# EAGLE design sensorCR123 (EAGLE 6.6.0)
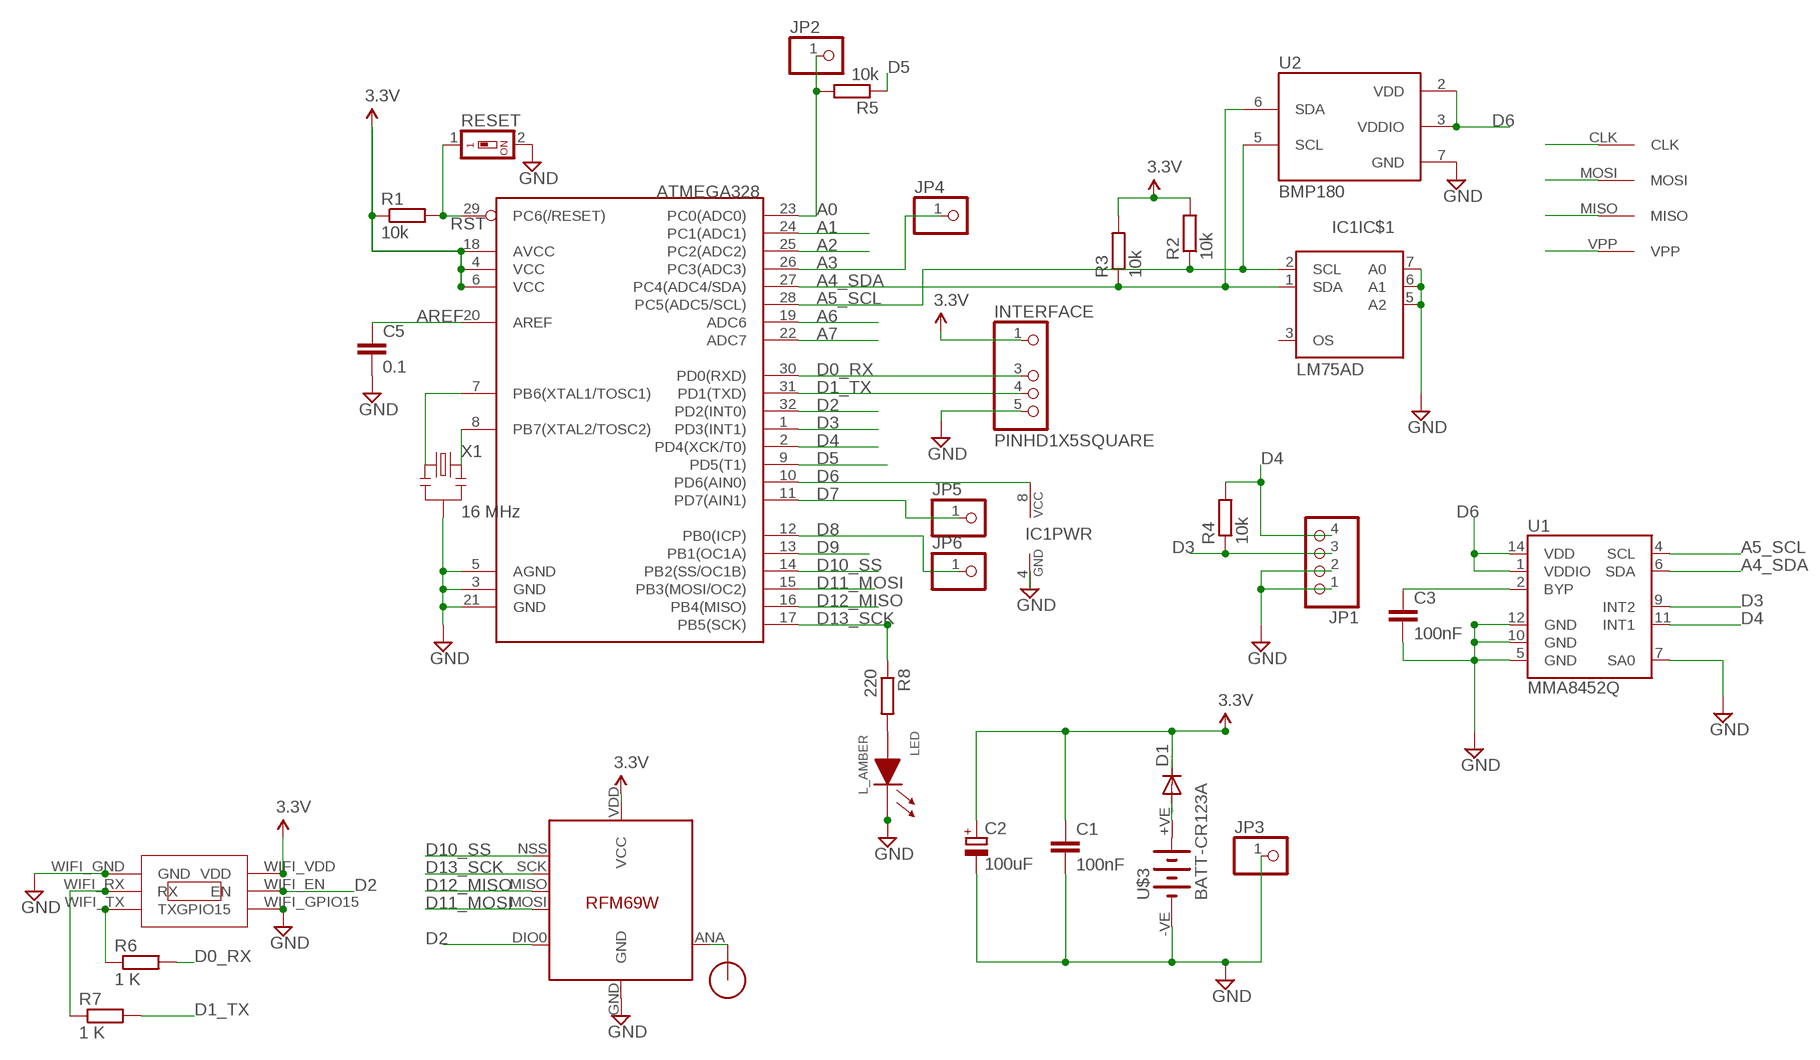
[diagram p0: schematic, sheet 1]

## Parts
ATMEGA328  ATMega-328  ATMEGA168/328TQFP32  [TQFP32-08]
C1  100nF  C-EUC2012  [C2012]
C2  100uF  CPOL-EUSMCB  [SMC_B]
C3  100nF  C-EUC2012  [C2012]
C5  0.1  C-EUC2012  [C2012]
D1  DIODE-DO214BA  [DO214BA]
IC1  LM75AD  [SO08]
INTERFACE  PINHD1X5SQUARE  [PINHD1X05-SQUARE]
JP1  PINHD-1X04_2.54-S  [1X04-S]
JP2  PINHD-1X01_2.54  [1X01]
JP3  PINHD-1X01_2.54  [1X01]
JP4  PINHD-1X01_2.54  [1X01]
JP5  PINHD-1X01_2.54  [1X01]
JP6  PINHD-1X01_2.54  [1X01]
LED  L_AMBER  LED0805  [LED0805]
R1  10k  R-EU_R2012  [R2012]
R2  10k  R-EU_R2012  [R2012]
R3  10k  R-EU_R2012  [R2012]
R4  10k  R-EU_R2012  [R2012]
R5  10k  R-EU_R2012  [R2012]
R6  1 K  R-EU_M2012  [M2012]
R7  1 K  R-EU_M2012  [M2012]
R8  220  R-EU_M2012  [M2012]
RESET  SWS001  [SMS-001]
U1  MMA8452Q  [QFN-16_0.5MM]
U2  BMP180  [BMP180]
U$1  RFM12B_ANTENNA  [RFM12B-ANTENNA]
U$2  AVRHEADERDIP  [AVRHEADER]
U$3  BATT-CR123A  [KEYSTONE-2/3A]
U$4  RFM69W  [RFM69W]
U$5  ESP03  [ESP03]
X1  16 MHz  RESONATORSMD  [RESONATOR-SMD]

## Nets
A0: ATMEGA328.23(PC0(ADC0)) JP2.1 R5.2
A1: ATMEGA328.24(PC1(ADC1))
A2: ATMEGA328.25(PC2(ADC2))
A3: ATMEGA328.26(PC3(ADC3)) JP4.1
A4_SDA: ATMEGA328.27(PC4(ADC4/SDA)) IC1.1(IC$1:SDA) R3.1 U1.6(SDA) U2.6(SDA)
A5_SCL: ATMEGA328.28(PC5(ADC5/SCL)) IC1.2(IC$1:SCL) R2.1 U1.4(SCL) U2.5(SCL)
A6: ATMEGA328.19(ADC6)
A7: ATMEGA328.22(ADC7)
AREF: ATMEGA328.20(AREF) C5.1
D0_RX: ATMEGA328.30(PD0(RXD)) INTERFACE.3 R6.2
D1_TX: ATMEGA328.31(PD1(TXD)) INTERFACE.4 R7.2
D2: ATMEGA328.32(PD2(INT0)) U$4.DIO0 U$5.WIFI_EN(EN)
D3: ATMEGA328.1(PD3(INT1)) JP1.3 R4.1 U1.9(INT2)
D4: ATMEGA328.2(PD4(XCK/T0)) JP1.4 R4.2 U1.11(INT1)
D5: ATMEGA328.9(PD5(T1)) R5.1
D6: ATMEGA328.10(PD6(AIN0)) IC1.8(PWR:VCC) U1.1(VDDIO) U1.14(VDD) U2.2(VDD) U2.3(VDDIO)
D7: ATMEGA328.11(PD7(AIN1)) JP5.1
D8: ATMEGA328.12(PB0(ICP)) JP6.1
D9: ATMEGA328.13(PB1(OC1A))
D10_SS: ATMEGA328.14(PB2(SS/OC1B)) U$4.NSS(SEL)
D11_MOSI: ATMEGA328.15(PB3(MOSI/OC2)) U$2.MOSI U$4.MOSI
D12_MISO: ATMEGA328.16(PB4(MISO)) U$2.MISO U$4.MISO
D13_SCK: ATMEGA328.17(PB5(SCK)) R8.1 U$2.CLK U$4.SCK
GND: ATMEGA328.3(GND) ATMEGA328.5(AGND) ATMEGA328.21(GND) C1.2 C2.- C3.2 C5.2 IC1.4(PWR:GND) IC1.5(IC$1:A2) IC1.6(IC$1:A1) IC1.7(IC$1:A0) INTERFACE.5 JP1.1 JP1.2 JP3.1 LED.1(CA) RESET.2 U1.5(GND) U1.7(SA0) U1.10(GND) U1.12(GND) U2.7(GND) U$3.-VE(-) U$4.GND U$5.WIFI_GND(GND) U$5.WIFI_GPIO15(GPIO15) X1.2
N$1: ATMEGA328.7(PB6(XTAL1/TOSC1)) X1.1
N$2: C3.1 U1.2(BYP)
N$3: U$1.P$1 U$4.ANA(ANT)
N$4: LED.2(AN) R8.2
N$5: D1.A U$3.+VE(+)
N$10: R6.1 U$5.WIFI_TX(TX)
N$11: R7.1 U$5.WIFI_RX(RX)
N$21: ATMEGA328.8(PB7(XTAL2/TOSC2)) X1.3
RST: ATMEGA328.29(PC6(/RESET)) R1.2 RESET.1 U$2.VPP
VCC: ATMEGA328.4(VCC) ATMEGA328.6(VCC) ATMEGA328.18(AVCC) C1.1 C2.+ D1.C INTERFACE.1 R1.1 R2.2 R3.2 U$4.VDD(VCC) U$5.WIFI_VDD(VDD) ; supply symbol labelled 3.3V
Unconnected: IC1.3(IC$1:OS)

## Library data of the parts
ATMEGA328 = LowPowerLab:ATMEGA168/328: Atmel 32-pin 8-bit micro, 16k flash.
C1 C3 C5 = resistor:C-EU: CAPACITOR, European symbol
C2 = resistor:CPOL-EU: POLARIZED CAPACITOR, European symbol
D1 = diode:DIODE-: DIODE
IC1 = i2c:LM75AD: Digital Temperature Sensor and Thermal Watchdog
INTERFACE = eagle-library-edeca.net-v5:PINHD1X5
JP1 = pinhead-2:PINHD-1X04: PIN HEADER
JP2-JP6 = pinhead-2:PINHD-1X01: PIN HEADER
LED = MySMD:LED0805
R1-R8 = resistor:R-EU_: RESISTOR, European symbol
RESET = smd-special:SWS001: SMD Dip Switch 1 pol.
U1 = SparkFun-Sensors:MMA8452Q: MMA8452Q 3-Axis, 12/8-bit Digital Accelerometer Supply Voltage: 1.6-3.6V Range: +/- 2g, 4g, 8g Interface: I2C, 12-bit and 8-bit ODR: 1.56 Hz - 800 Hz Package: QFN-16 http://cache.freescale.com/files/sensors/doc/data_sheet/MMA8452Q.pdf; PROD_ID: IC-10769
U2 = SparkFun-Sensors:BMP180: BOSCH BMP180 DIGITAL BAROMETRIC PRESSURE SENSOR Web page: http://www.bosch-sensortec.com/en/homepage/products_3/environmental_sensors_1/bmp180_1/bmp180 Datasheet: http://ae-bst.resource.bosch.com/media/products/dokumente/bmp180/BST-BMP180-DS000-09.pdf The BMP180 is the function compatible successor of the BMP085, a new generation of high precision digital pressure sensors for consumer applications. The ultra-low power, low voltage electronics of the BMP180 is optimized for use in mobile phones, PDAs, GPS navigation devices and outdoor equipment. With a low altitude noise of merely 0.25m at fast conversion time, the BMP180 offers superior performance. The I2C interface allows for easy system integration with a microcontroller. The BMP180 is based on piezo-resistive technology for EMC robustness, high accuracy and linearity as well as long term stability. Key features: - Temperature measurement included - I2C interface - Fully calibrated - Pb-free, halogen-free and RoHS compliant, - MSL 1 Basic specs: Pressure range: 300 to 1100hPa (+9000m to -500m relating to sea level) Supply voltage: 1.8 to 3.6V (VDD), 1.62V to 3.6V (VDDIO) Package: LGA package with metal lid Small footprint: 3.6mm x 3.8mm Super-flat: 0.93mm height Low power: 5μA at 1 sample / sec. in standard mode Low noise: 0.06hPa (0.5m) in ultra low power mode, 0.02hPa (0.17m) advanced resolution mode Typical applications: - Enhancement of GPS navigation (dead-reckoning, slope detection, etc.) - In- and out-door navigation - Leisure and sports - Weather forecast - Vertical velocity indication (rise/sink speed)
U$1 = LowPowerLab:RFM12B_ANTENNA
U$2 = RemoteHome:AVRHEADER
U$3 = eagle-library-edeca.net-v5:BATT-CR123A: CR123A (2/3rd AA) battery holder Manufacturer: Keystone Mouser part: 534-1019
U$4 = RemoteHome:RFM69W
U$5 = RemoteHome:ESP03
X1 = SparkFun:RESONATOR: Resonator Small SMD resonator. This is the itty bitty 10/20MHz resonators with built in caps. CSTCE10M0G55 and CSTCE20M0V53. Footprint has been reviewed closely but hasn't been tested yet.

## Net classes
1 power: width 0.381 mm, clearance 0.254 mm

## Board
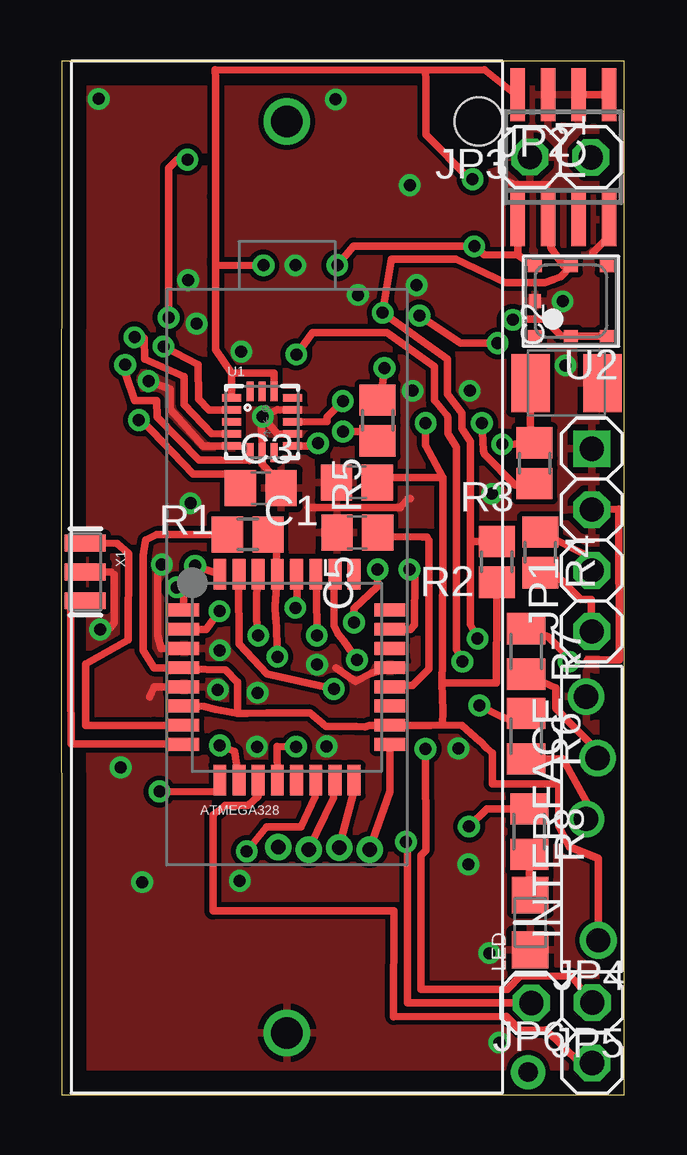
[diagram p1: board, top side]
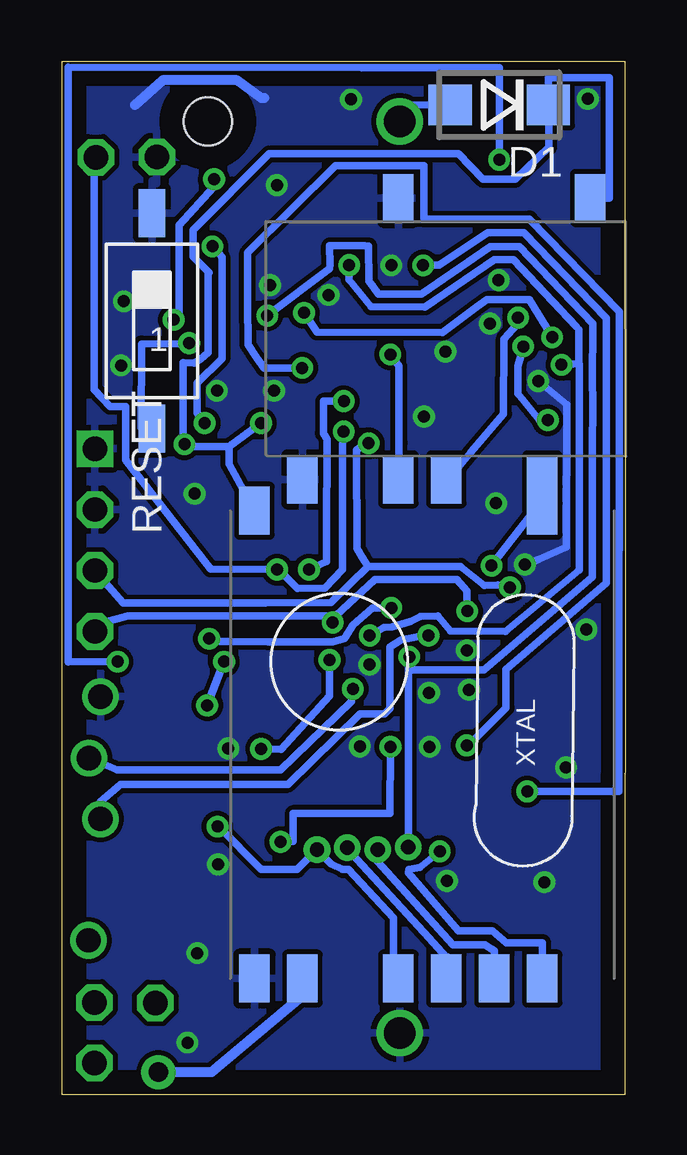
[diagram p2: board, bottom side, seen from below]

Size 23.48 x 43.09 mm. Coordinates in mm from the lower left corner, seen from the top.
Outline: 0.02,0 23.48,0.01 23.47,43.09 0.02,43.09 0.02,37.02 0,26.86 0.02,0
Copper layers (1*16): Top 0.035mm / dielectric 1.5mm / Bottom 0.035mm
Design rules "default": minimum track width 10mil, minimum drill 24mil, track to track 8mil, track to pad 8mil, pad to pad 8mil, via to via 8mil, smd to smd 8mil, copper to edge 40mil, drill to drill 8mil, minimum pad ring 10mil, minimum via ring 8mil, stop-mask expansion 4mil, vias tented up to drill 0mil, thermal gap 10mil

### Footprints (pad centres in the part's own frame; a part is rotated, then mirrored left to right if it is on the bottom)
TQFP32-08 = smd 1.27 x 0.533: 1 -4.293,2.8; 2 -4.293,2; 3 -4.293,1.2; 4 -4.293,0.4; 5 -4.293,-0.4; 6 -4.293,-1.2; 7 -4.293,-2; 8 -4.293,-2.8; 17 4.293,-2.8; 18 4.293,-2; 19 4.293,-1.2; 20 4.293,-0.4; 21 4.293,0.4; 22 4.293,1.2; 23 4.293,2; 24 4.293,2.8 | smd 0.533 x 1.27: 9 -2.8,-4.293; 10 -2,-4.293; 11 -1.2,-4.293; 12 -0.4,-4.293; 13 0.4,-4.293; 14 1.2,-4.293; 15 2,-4.293; 16 2.8,-4.293; 25 2.8,4.293; 26 2,4.293; 27 1.2,4.293; 28 0.4,4.293; 29 -0.4,4.293; 30 -1.2,4.293; 31 -2,4.293; 32 -2.8,4.293
C2012 = smd 1.3 x 1.5: 1 -0.85,0; 2 0.85,0
SMC_B = smd 1.6 x 2.4: + -1.5,0; - 1.5,0
DO214BA = smd 1.8 x 1.7: A 2.05,0; C -2.05,0
SO08 = smd 0.6 x 2.2: 1 -1.905,-2.6; 2 -0.635,-2.6; 3 0.635,-2.6; 4 1.905,-2.6; 5 1.905,2.6; 6 0.635,2.6; 7 -0.635,2.6; 8 -1.905,2.6
PINHD1X05-SQUARE = drill 1.016: 1 -5.061,-0.269; 3 0,0.24; 4 2.54,-0.24; 5 5.099,0.24
1X04-S = drill 1.016 square: 1 -3.81,0 | drill 1.016 octagon: 2 -1.27,0; 3 1.27,0; 4 3.81,0
1X01 = drill 1.016 octagon: 1 0,0
LED0805 = smd 1.524 x 1.524: 1 0,0; 2 2.286,0
R2012 = smd 1.3 x 1.5: 1 -0.85,0; 2 0.85,0
M2012 = smd 1.3 x 1.6: 1 -0.95,0; 2 0.95,0
SMS-001 = smd 1.092 x 2.007: 1 0,-4.496; 2 0,4.496
QFN-16_0.5MM = smd 0.8 x 0.3: 1 -1.275,1; 2 -1.275,0.5; 3 -1.275,0; 4 -1.275,-0.5; 5 -1.275,-1; 9 1.275,-1; 10 1.275,-0.5; 11 1.275,0; 12 1.275,0.5; 13 1.275,1 | smd 0.3 x 0.8: 6 -0.5,-1.275; 7 0,-1.275; 8 0.5,-1.275; 14 0.5,1.275; 15 0,1.275; 16 -0.5,1.275
BMP180 = smd 0.6 x 0.5: 1 1.5,1.45; 2 0,1.45; 3 -1.5,1.45; 4 -1.5,-1.45; 5 0,-1.45; 6 1.5,-1.45 | smd 0.5 x 0.6: 7 1.5,0
RFM12B-ANTENNA = drill 0.8 pad 1.422: P$1 0,0
AVRHEADER = drill 0.6 pad 0.813: CLK 2.54,0; MISO 1.27,0.091; MOSI 0,0; VPP -1.27,0.099
KEYSTONE-2/3A = drill 1.3: +VE 0,19; -VE 0,-19 | hole 2: 8,19
RFM69W = smd 2 x 1.27: ANA 9.27,-5; DIO0 -10.23,5; GND 9.27,-7; MISO 9.27,1; MOSI 9.27,3; NSS 9.27,5; SCK 9.27,-1; VDD -10.23,-7
ESP03 = smd 1.27 x 2: WIFI_EN 3.27,-6; WIFI_GND -6.73,-6; WIFI_GPIO15 -2.73,5.73; WIFI_RX -0.73,-6; WIFI_TX -2.73,-6; WIFI_VDD 5.27,5.73
RESONATOR-SMD = smd 0.7 x 1.7: 1 -1.2,0; 2 0,0; 3 1.2,0

### Placement (x,y rotation side)
ATMEGA328  9.41,17.41 0 top
C1  12.32,25.53 180 top
C2  21.06,29.67 0 top
C3  8.32,25.29 0 top
C5  12.34,23.44 180 top
D1  5.25,41.27 180 bottom
IC1  20.93,39.09 0 top
INTERFACE  22.12,11.5 90 top
JP1  22.12,23.13 270 top
JP2  22.08,39.08 0 top
JP3  19.54,39.09 0 top
JP4  22.14,3.85 0 top
JP5  22.13,1.33 0 top
JP6  19.6,3.84 0 top
LED  19.55,6.05 90 top
R1  7.77,23.37 0 top
R2  18.16,22.22 270 top
R3  19.73,26.33 90 top
R4  19.97,22.62 270 top
R5  13.19,28.12 270 top
R6  19.37,14.95 270 top
R7  19.38,18.49 270 top
R8  19.52,10.97 270 top
RESET  19.74,32.27 0 bottom
U1  8.37,28.06 0 top
U2  21.25,33.09 180 top
U$1  19.47,0.95 0 top
U$2  10.32,10.22 0 top
U$3  9.4,21.58 0 top
U$4  8.46,14.13 270 bottom
U$5  6.73,31.65 0 bottom
X1  1,21.8 270 top

### Tracks (layer width: path | path; a pad name or v marks a point on that pad's centre or on a via)
A0  (via drill 0.5)
  Top 0.305: v14.52,21.9 14.75,21.71 14.73,19.59 14.55,19.41 ATMEGA328.23 | ATMEGA328.23 | v11.74,27.65 12.99,27.66 R5.2
  Bottom 0.305: JP2.1 22.08,39.03 22.14,39.01 22.14,29.41 21.47,28.69 20.83,28.69 20.83,26.47 17.3,21.92 v14.52,21.9 14.4,21.86 14.48,21.89 14.41,21.85 14.3,21.74 13.67,21.11 12.51,21.12 11.78,21.91 11.78,27.03 v11.74,27.65
A3  (via drill 0.5)
  Top 0.305: ATMEGA328.26 11.38,21.7 11.38,19.56 11.55,19.22 11.77,18.94 v12.33,18.13 | v15.19,14.42 15.2,10.2 14.99,9.99 14.99,4.41 18.58,4.4 18.59,4.4 19.15,4.96 21.27,4.95 JP4.1
  Bottom 0.305: v12.33,18.13 12.34,16.64 14.36,14.4 v15.19,14.42
A4_SDA  (via drill 0.5)
  Top 0.305: ATMEGA328.27 10.64,20.98 v10.66,19.15 | U1.6 7.85,26.45 6.64,26.46 6.11,26.46 5.74,26.46 4,28.27 3.97,28.94 3.05,28.94 2.69,30.04 v2.66,30.44 | IC1.1 19.03,35 | 19.03,35 U2.6 | R3.1 18.92,25.41 17.64,26.72 17.6,26.85 v17.54,28.01 | 19.03,35 17.62,35.02 17.31,35.37 v17.22,35.38 12.19,35.39 v11.51,34.59
  Bottom 0.305: v10.66,19.15 10.05,19.48 9.73,19.51 8.96,19.73 8.54,19.95 7.81,19.96 7.29,19.34 5,19.31 1.92,21.88 1.92,30.47 1.93,30.48 | 1.93,30.48 1.94,31.9 2.05,32.03 4.67,34.82 5.04,34.81 5.46,34.81 8.34,32.85 10.61,32.86 11.52,33.98 11.51,34.15 v11.51,34.59 | v17.22,35.38 16.81,34.92 16.82,30.7 17.85,29.67 17.85,28.43 17.71,28.24 v17.54,28.01 | v2.66,30.44 2.18,30.45 1.93,30.48
A5_SCL  (via drill 0.5)
  Top 0.305: ATMEGA328.28 9.83,20.6 v9.76,20.3 | U1.4 6.27,27.56 5.13,28.77 5.12,29.94 3.47,30.68 3.45,31.55 3.16,31.62 v3.05,31.58 | IC1.2 20.29,36.48 20.42,35.31 20.96,34.55 U2.5 20.82,34.11 20.51,33.98 20.16,33.86 18.51,33.86 16.45,34.83 13.77,34.83 v13.4,32.6 16.1,30.67 16.1,30.09 16.1,29.22 16.7,28.43 16.7,27.78 17.05,27.24 17.06,24.33 17.05,23.81 17.06,23.16 | 17.06,23.16 17.05,19.6 v17.36,19.02 | R2.1 17.11,23.06 17.06,23.16
  Bottom 0.305: v9.76,20.3 10.55,20.3 11.36,19.58 11.7,19.04 12.21,18.88 13.98,18.89 14.9,18.89 16.47,18.89 16.89,18.89 v17.36,19.02 | v3.05,31.58 4,33.14 5.78,33.15 6.2,32.85 7.63,31.78 12.85,31.8 v13.4,32.6
AREF
  Top 0.305: C5.1 13.58,23.27 15.06,23.26 15.25,23.25 15.33,23.11 15.34,22.83 15.33,22.65 15.33,17.76 14.63,17.07 13.76,17.07 ATMEGA328.20
D0_RX  (via drill 0.5)
  Top 0.305: v8.21,19.15 8.15,19.84 8.14,20.07 8.15,21.89 ATMEGA328.30 | R6.2 20.92,14 21.88,12.24 INTERFACE.3
  Bottom 0.305: v8.21,19.15 8.38,19.15 9.35,18.96 9.81,18.67 9.81,16.1 10.04,15.88 11.06,15.89 14.07,12.94 21.05,12.95 21.88,12.24 INTERFACE.3
D1_TX  (via drill 0.5)
  Top 0.305: v11.36,16.92 8.57,17.55 7.41,18.81 7.4,21.41 ATMEGA328.31 | R7.2 20.62,16.95 20.62,16.12 21.27,15.44 22.35,14.36 INTERFACE.4
  Bottom 0.305: v11.36,16.92 11.42,16.41 14.37,13.54 21.18,13.54 INTERFACE.4
D2  (via drill 0.5)
  Top 0.305: v5.57,22.06 5.86,21.95 ATMEGA328.32
  Bottom 0.305: 3.51,25.05 3.86,25.47 3.88,24.26 v5.57,22.06
  Bottom 0.406: 3.51,25.05 3.55,24.83 U$4.DIO0 3.47,25.31 U$5.WIFI_EN
D3  (via drill 0.5)
  Top 0.305: ATMEGA328.1 5.09,20.76 v4.81,21.16 | R4.1 22.11,22.38 JP1.3 | v10.7,27.16 10.63,27.09 10.6,27.06 9.85,27.05 U1.9
  Bottom 0.305: JP1.3 20.93,20.51 18.42,20.5 15,20.5 12.26,20.52 10.72,22.02 | 10.72,22.02 6.86,22.04 5.88,21.23 5.31,21.25 v4.81,21.16 | 10.72,22.02 10.97,22.43 11.18,22.79 11.2,26.89 10.8,27.16 v10.7,27.16
D4  (via drill 0.5)
  Top 0.305: ATMEGA328.2 6.04,19.41 v6.59,20.16 | U1.11 11.08,28.06 11.08,28.25 v11.74,28.92 | R4.2 20.55,21.77 21.66,20.66 22.11,20.66 JP1.4 | v13.19,21.9 13.18,21.2 12.21,20.27 12.19,20.04 v12.2,19.7
  Bottom 0.305: v6.59,20.16 6.61,21 7.02,21.48 10.45,21.48 12.09,19.96 | 12.09,19.96 20.76,19.97 21.74,19.69 JP1.4 | v13.19,21.9 12.46,22.24 12.46,23.28 12.44,27.33 12.59,27.58 12.58,28.86 12.58,28.92 v11.74,28.92 | 12.09,19.96 v12.2,19.7
D5  (via drill 0.5)
  Top 0.305: R5.1 13.35,29.23 v13.47,30.31 | v4.09,12.65 6.6,12.64 ATMEGA328.9
  Bottom 0.305: v13.47,30.31 15.06,30.29 15.38,30.74 15.73,31.28 15.74,33.02 15.74,35.1 12.08,38.74 10.46,38.73 9.62,38.73 8.4,38.74 8.39,36.52 3.99,36.52 0.25,32.66 0.26,12.66 v4.09,12.65
D6  (via drill 0.5)
  Top 0.305: U1.1 7.09,30.09 | 7.09,30.09 8.87,30.09 U1.14 | IC1.8 18.94,41.69 17.65,42.73 15.18,42.72 | 15.18,42.72 6.41,42.73 6.43,42.37 6.43,37.44 6.44,34.88 | 6.44,34.88 6.43,31.08 7.09,30.09 | U2.3 U2.2 20.82,31.65 20.14,32.33 18.85,32.33 v18.83,32.31 | v17.15,38.17 17.05,38.17 15.19,40.02 15.19,42.25 15.18,42.72 | ATMEGA328.10 7.23,14.32 v6.61,14.57 | v8.43,34.58 6.44,34.57 6.44,34.88
  Bottom 0.305: v18.83,32.31 18.61,32.31 18.61,32.63 18.6,36.26 17.17,37.83 17.17,38.17 v17.15,38.17 | v6.61,14.57 6.52,14.59 4.97,16.13 4.97,17.73 0.79,21.35 0.8,25.59 0.8,25.69 0.8,32.38 4.23,35.94 5.74,35.94 7.78,34.58 v8.43,34.58
D7
  Top 0.305: JP5.1 21.61,1.33 20.2,2.71 19.14,2.7 18.57,3.27 13.86,3.26 13.87,7.67 6.32,7.67 6.32,11.66 6.84,12.07 7.79,12.07 8.21,12.44 ATMEGA328.11
D8  (via drill 0.5)
  Top 0.305: ATMEGA328.12 9,14.53 v9.79,14.51 | v14.37,10.54 14.44,10.54 14.44,3.84 JP6.1
  Bottom 0.305: v9.79,14.51 9.81,11.73 13.84,11.73 13.84,10.56 14.37,10.56 v14.37,10.54
D10_SS  (via drill 0.5)
  Top 0.305: v7.73,10.16 8.55,11.17 10,11.18 10.57,12.42 ATMEGA328.14
  Bottom 0.305: v7.73,10.16 8.56,9.48 9.03,9.4 9.03,9.25 8.91,9.1 6.96,6.83 5.54,6.83 4.95,6.34 3.46,6.34 U$4.NSS
D11_MOSI
  Top 0.305: ATMEGA328.15 11.36,12.38 U$2.MOSI
  Bottom 0.305: U$2.MOSI 10.32,9.73 7.19,6.26 5.86,6.27 5.46,6 U$4.MOSI
D12_MISO
  Top 0.305: ATMEGA328.16 12.17,12.6 U$2.MISO
  Bottom 0.305: U$2.MISO 11.44,10.09 8.39,6.79 7.43,5.71
  Bottom 0.406: U$4.MISO 7.43,4.91 7.43,5.71
D13_SCK  (via drill 0.5)
  Top 0.305: ATMEGA328.17 13.71,12.65 U$2.CLK | R8.1 17.74,11.92 v17,11.18
  Bottom 0.305: 9.67,5.72 9.67,6.88 9.67,7.38 11.54,9.39 11.79,9.39 12.27,9.62 12.55,9.93 U$2.CLK 13.68,9.4 15.18,9.4 16.97,11.18 v17,11.18
  Bottom 0.406: U$4.SCK 9.64,5.5 9.67,5.72
GND  (via drill 0.5)
  Top 0.305: ATMEGA328.5 3.86,17.01 3.68,16.58 | ATMEGA328.3 4.17,18.61 4.01,19.16 4.01,21.65 v4.19,22.11 | v8.4,28.27 9.02,27.55 U1.10 | X1.2 2.08,21.8 2.21,21.69 2.21,19.69 2.19,19.66 2.04,19.46 v1.62,19.4 | v3.63,29.75 4.53,29.41 4.54,28.58 5.92,27.06 U1.5 | IC1.6 IC1.5 | IC1.4 22.84,35.79 22.15,35.1 | 14.57,24.86 14.45,24.86 14.13,24.48 10.29,24.48 | 18.48,38.14 18.92,37.95 20.26,37.95 | 21.93,18.13 23.27,18.12 23.25,24.41 22.54,24.4 JP1.2 | 11.44,17.8 12.26,17.24 12.92,17.56 ATMEGA328.21 | v8.4,28.27 8.35,27.95 U1.7 8.37,26.32 9.25,25.32 C3.2 | U1.12 9.02,28.56 v8.4,28.27
  Bottom 0.305: v4.19,22.11 3.62,22.31 2.45,22.85 2.44,28.79 v3.63,29.75
  Bottom 0.406: 15.06,41.55 15.17,41.55 16.18,42.29 19.29,42.29 20.45,41.26
  other vias: 6.61,18.53 6.52,16.89 8.19,16.77 10.66,17.94 11.07,14.52 17.85,5.91 7.5,30.99 5.64,32.15 5.29,33.96 12.37,33.35 20.91,33.08 17.03,29.35 21.03,30.41 14.65,29.35 17.96,25.06 8.16,14.52 3.37,8.87 16.98,9.61 16.56,14.44 2.47,13.65 1.56,41.52 11.44,41.5 18.26,2.18 7.44,8.92 9.76,34.58 14.82,33.76 14.53,37.92 5.39,24.67
  pour Top: 0.37,0.25 0.29,42.79 23.23,42.84 23.25,0.22
  pour Bottom: 0.3,42.74 23.2,42.87 23.27,0.24 0.36,0.31
N$1
  Top 0.305: X1.1 2.33,22.98 2.81,22.57 2.79,18.96 1.03,17.97 1.03,15.4 3.87,15.4 4.46,15.4 ATMEGA328.7
N$2  (via drill 0.5)
  Top 0.305: C3.1 6.94,25.87 5.49,25.88 3.35,28.14 v3.23,28.13 | v4.26,31.2 5.71,30.45 5.72,29.01 6.16,28.56 U1.2
  Bottom 0.305: v4.26,31.2 4.47,30.37 4.48,29.71 4.47,29.23 3.57,28.14 v3.23,28.13
N$3
  Bottom 0.305: U$4.ANA 13.46,4.03 13.49,4.08
  Bottom 0.406: 13.49,4.08 17.25,0.94 18.55,0.94 U$1.P$1
N$4
  Top 0.305: LED.2 19.51,8.37 R8.2
N$5
  Bottom 0.305: D1.A 9.4,41.25 U$3.+VE
N$10  (via drill 0.5)
  Top 0.305: R6.1 18.91,15.6 18.36,15.76 v17.43,16.24 | v16.73,18.06 16.47,18.57 16.47,27.01 16.12,27.58 16.11,28.21 16.1,28.3 15.56,28.96 15.56,30.37 13.57,31.78 10.47,31.78 v9.8,30.87
  Bottom 0.305: U$5.WIFI_TX 9.43,27.19 9.44,30.39 v9.8,30.87 | v17.43,16.24 v16.73,18.06
N$11  (via drill 0.5)
  Top 0.305: R7.1 20.3,19.1 21.17,18.23 v21.17,18.06 | v4.47,32.4 4.47,38.64 4.82,38.99 v5.26,38.99
  Bottom 0.305: U$5.WIFI_RX 6.95,26.15 6.44,26.79 5.07,28.39 5.05,31.5 4.51,32.13 4.52,32.11 v4.47,32.4 | v21.17,18.06 23.23,18.05 23.23,42.84 11.01,42.82 5.25,42.83 v5.26,38.99
N$21
  Top 0.305: X1.3 0.4,20.58 0.4,18.46 0.39,17.3 0.41,14.62 4.76,14.63 ATMEGA328.8
RST  (via drill 0.5)
  Top 0.305: v9.01,18.26 8.96,19.89 8.94,19.87 8.91,20.39 ATMEGA328.29 9,21.98 8.95,23.34 8.95,23.43 R1.2 | v18.19,31.34 16.63,31.35 v14.93,32.49
  Bottom 0.305: 9.04,17.72 9.05,12.7 9.05,11.54 U$2.VPP | 9.04,17.72 v9.01,18.26 | 9.04,17.72 5.9,17.72 1.37,21.59 1.37,26.06 1.37,26.75 1.35,28.96 1.37,29.69 1.36,32.15 4.41,35.36 5.63,35.36 8.5,33.39 10.28,33.39 10.69,33.92 10.71,35.39 10.88,35.39 12.32,35.4 12.32,34.61 12.33,34.45 v14.93,32.49 | RESET.1 20.19,27.82 20.18,31.3 18.25,31.31 v18.19,31.34
VCC  (via drill 0.5)
  Top 0.305: ATMEGA328.6 5.95,16.2 6.44,16.07 7.34,15.91 | 7.34,15.91 7.74,15.9 8.58,15.92 10.36,15.92 11.04,15.37 11.63,15.36 12.3,15.36 12.66,15.35 12.85,15.41 12.94,15.41 ATMEGA328.18 14.11,15.41 15.4,15.41 15.9,15.42 | 7.34,15.91 7.34,17.21 7.33,17.21 6.85,17.72 5.22,17.75 ATMEGA328.4 4.59,17.8 3.86,17.8 3.41,18.53 3.42,22.49 3.42,22.63 3.52,23.12 3.97,23.36 R1.1 | INTERFACE.1 22.39,9.86 21.19,10.33 20.75,11.19 20.76,12.96 17.97,12.97 17.98,13.11 17.98,14.26 17.73,14.47 17.5,14.71 17.44,14.76 16.7,15.41 15.9,15.42 | 15.88,17.16 15.9,18.12 15.91,23.63 15.9,24.45 15.91,25.74 | 15.88,17.16 15.89,16.6 15.9,16 15.9,15.42 | C2.+ 19.56,27.21 R3.2 18.65,27.11 v18.38,27.12 | 15.91,25.74 13.7,25.73 C1.1 | 15.91,25.74 15.18,27.09 v15.19,28 | R2.2 18.16,19.58 18.16,19.37 18.15,18.45 18.15,17.16 15.88,17.16
  Bottom 0.305: 18.44,27.02 18.44,30.52 17.99,30.5 17.7,30.66 17.4,30.94 17.4,31.63 17.39,34.29 17.35,34.28 18.02,34.95 18.02,36.05 14.85,39.23 6.96,39.23 5.93,38.16 4.58,38.16 3.19,39.5 D1.C 3.2,42.39 0.67,42.39 0.67,37.38 U$5.WIFI_VDD | 18.44,27.02 16.87,27.02 16.51,27.04 | v18.38,27.12 18.42,27.13 18.44,27.02 | v15.19,28 16.51,27.04 | U$4.VDD 16.52,26.29 16.51,27.04